# Altium schematic sheet ADC.SchDoc
size A3; Author: Швецов С.В.; Organization: PapuaSoft; SheetNumber: 2; SheetTotal: 8
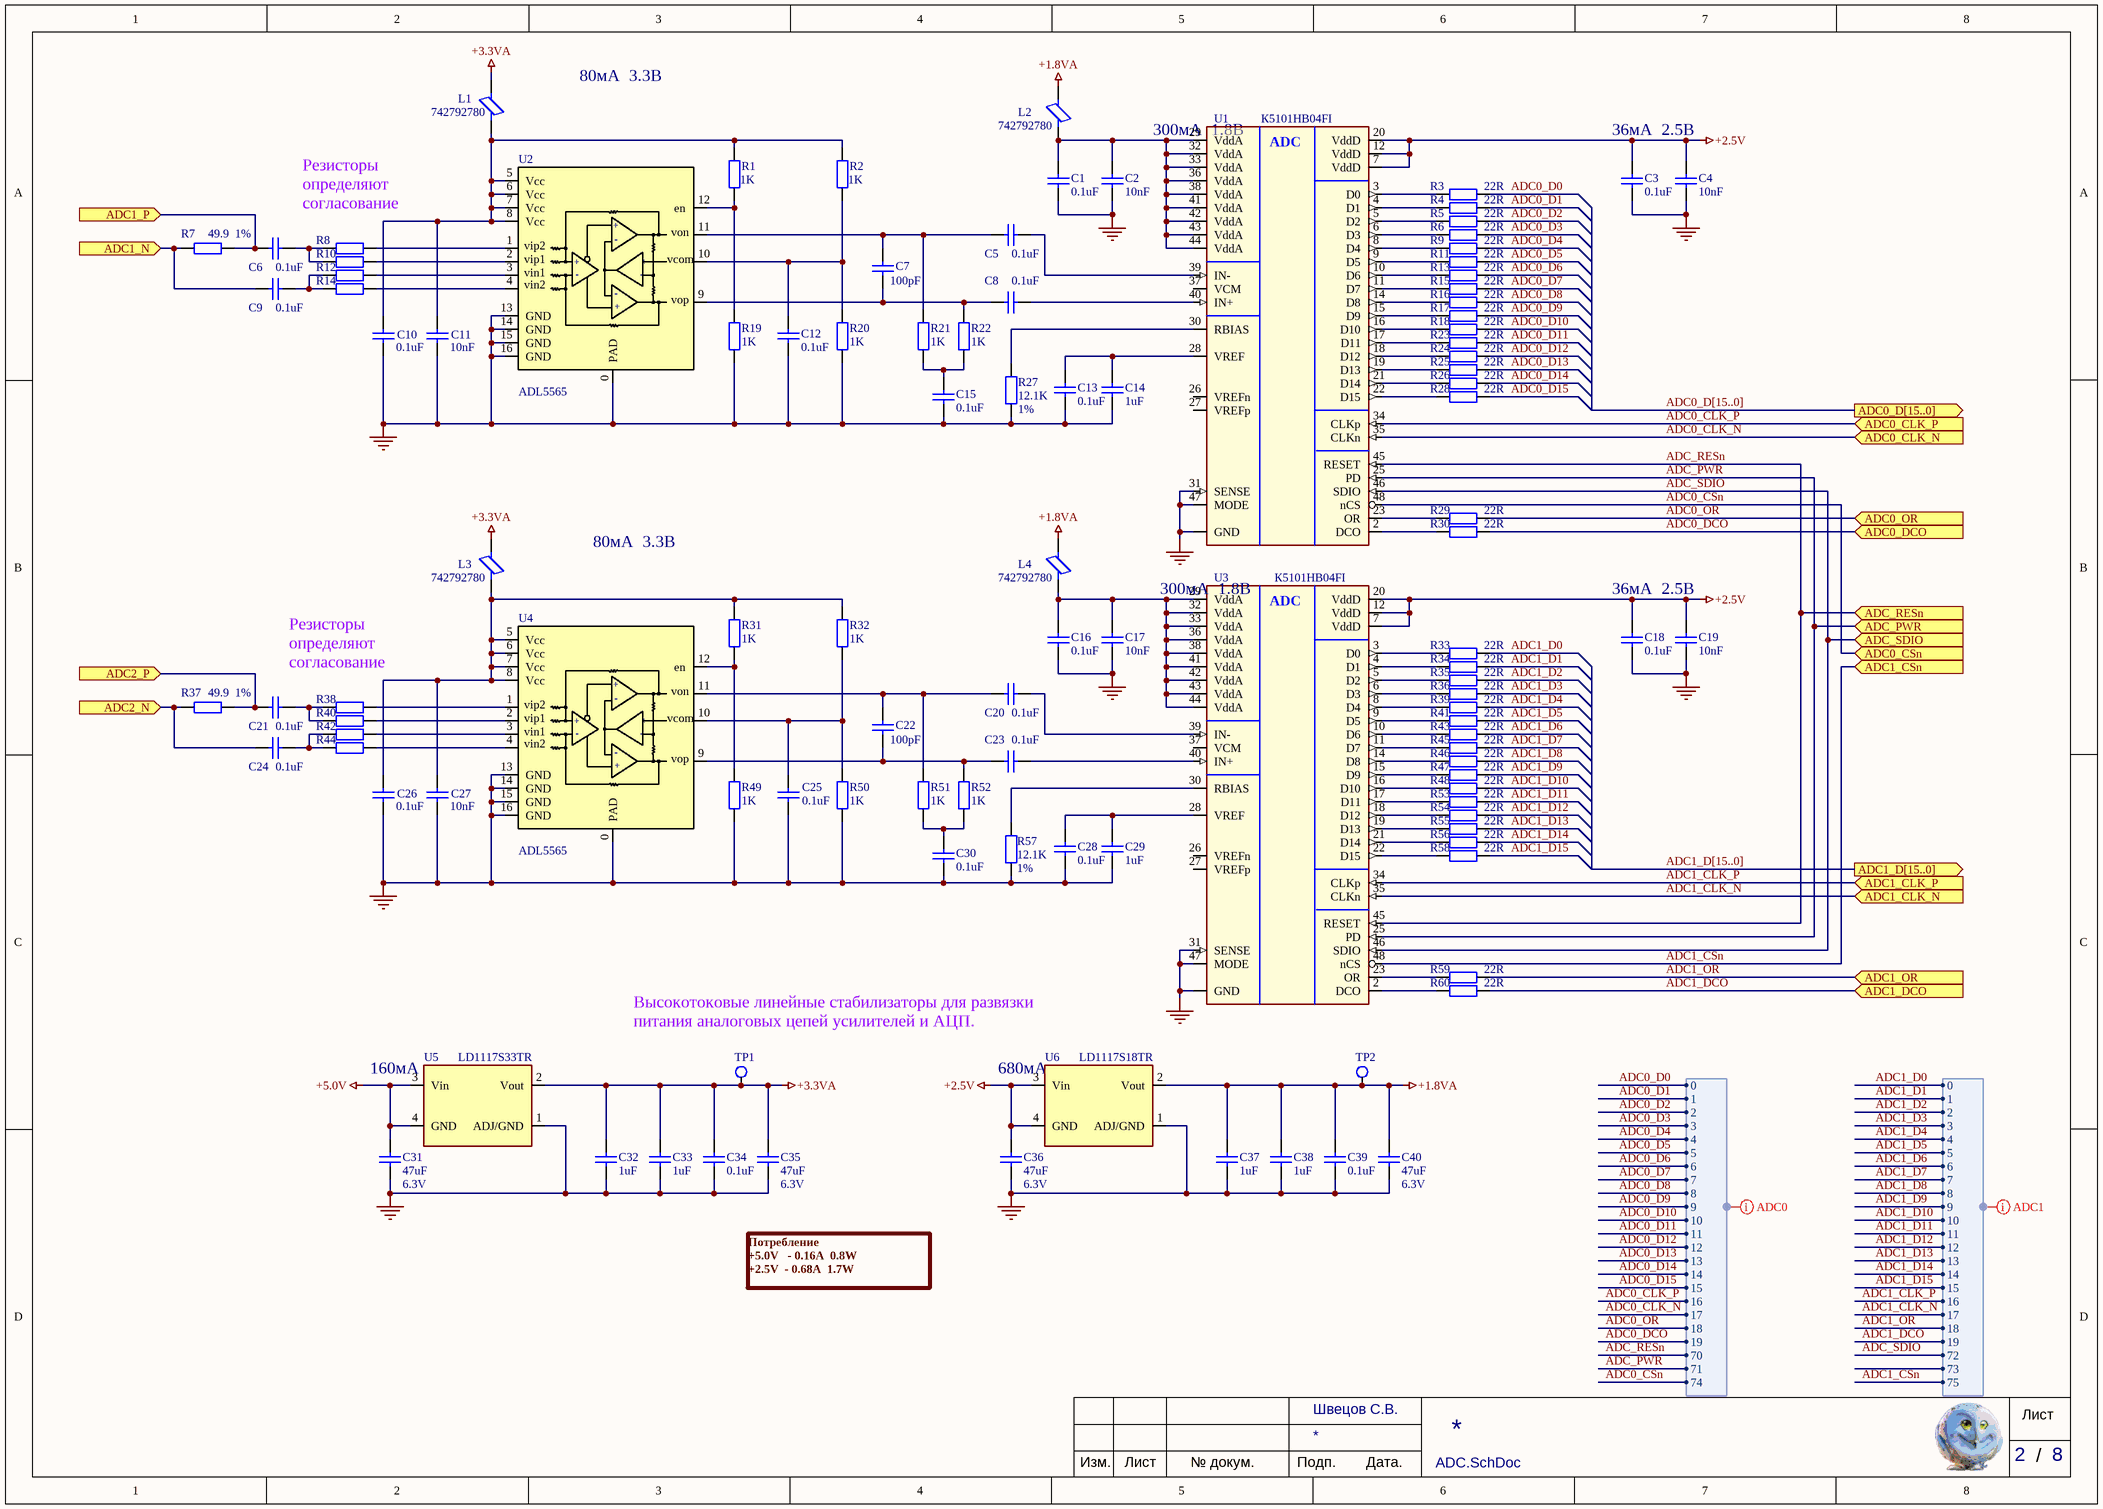
[diagram p0: ADC.SchDoc]

## Parts
C1  value 0.1uF  [C0402]  (hidden comment: Cap)
C2  value 10nF  [C0402]  (hidden comment: Cap)
C3  value 0.1uF  [C0402]  (hidden comment: Cap)
C4  value 10nF  [C0402]  (hidden comment: Cap)
C5  value 0.1uF  [C0402]  (hidden comment: Cap)
C6  value 0.1uF  [C0402]  (hidden comment: Cap)
C7  value 100pF  [C0402]  (hidden comment: Cap)
C8  value 0.1uF  [C0402]  (hidden comment: Cap)
C9  value 0.1uF  [C0402]  (hidden comment: Cap)
C10  value 0.1uF  [C0402]  (hidden comment: Cap)
C11  value 10nF  [C0402]  (hidden comment: Cap)
C12  value 0.1uF  [C0402]  (hidden comment: Cap)
C13  value 0.1uF  [C0402]  (hidden comment: Cap)
C14  value 1uF  [C0603]  (hidden comment: Cap)
C15  value 0.1uF  [C0402]  (hidden comment: Cap)
C16  value 0.1uF  [C0402]  (hidden comment: Cap)
C17  value 10nF  [C0402]  (hidden comment: Cap)
C18  value 0.1uF  [C0402]  (hidden comment: Cap)
C19  value 10nF  [C0402]  (hidden comment: Cap)
C20  value 0.1uF  [C0402]  (hidden comment: Cap)
C21  value 0.1uF  [C0402]  (hidden comment: Cap)
C22  value 100pF  [C0402]  (hidden comment: Cap)
C23  value 0.1uF  [C0402]  (hidden comment: Cap)
C24  value 0.1uF  [C0402]  (hidden comment: Cap)
C25  value 0.1uF  [C0402]  (hidden comment: Cap)
C26  value 0.1uF  [C0402]  (hidden comment: Cap)
C27  value 10nF  [C0402]  (hidden comment: Cap)
C28  value 0.1uF  [C0402]  (hidden comment: Cap)
C29  value 1uF  [C0603]  (hidden comment: Cap)
C30  value 0.1uF  [C0402]  (hidden comment: Cap)
C31  value 47uF  Voltage: 6.3V  [C0805]  (hidden comment: Cap)
C32  value 1uF  [C0603]  (hidden comment: Cap)
C33  value 1uF  [C0603]  (hidden comment: Cap)
C34  value 0.1uF  [C0402]  (hidden comment: Cap)
C35  value 47uF  Voltage: 6.3V  [C0805]  (hidden comment: Cap)
C36  value 47uF  Voltage: 6.3V  [C0805]  (hidden comment: Cap)
C37  value 1uF  [C0603]  (hidden comment: Cap)
C38  value 1uF  [C0603]  (hidden comment: Cap)
C39  value 0.1uF  [C0402]  (hidden comment: Cap)
C40  value 47uF  Voltage: 6.3V  [C0805]  (hidden comment: Cap)
L1  742792780  [L0402]
L2  742792780  [L0402]
L3  742792780  [L0402]
L4  742792780  [L0402]
R1  value 1K  [R0402]  (hidden comment: Res2)
R2  value 1K  [R0402]  (hidden comment: Res2)
R3  value 22R  [R0402]  (hidden comment: Res2)
R4  value 22R  [R0402]  (hidden comment: Res2)
R5  value 22R  [R0402]  (hidden comment: Res2)
R6  value 22R  [R0402]  (hidden comment: Res2)
R7  value 49.9  Precision: 1%  [R0402]  (hidden comment: Res2)
R8  Res2  [R0402]  (value not drawn)
R9  value 22R  [R0402]  (hidden comment: Res2)
R10  Res2  [R0402]  (value not drawn)
R11  value 22R  [R0402]  (hidden comment: Res2)
R12  Res2  [R0402]  (value not drawn)
R13  value 22R  [R0402]  (hidden comment: Res2)
R14  Res2  [R0402]  (value not drawn)
R15  value 22R  [R0402]  (hidden comment: Res2)
R16  value 22R  [R0402]  (hidden comment: Res2)
R17  value 22R  [R0402]  (hidden comment: Res2)
R18  value 22R  [R0402]  (hidden comment: Res2)
R19  value 1K  [R0402]  (hidden comment: Res2)
R20  value 1K  [R0402]  (hidden comment: Res2)
R21  value 1K  [R0402]  (hidden comment: Res2)
R22  value 1K  [R0402]  (hidden comment: Res2)
R23  value 22R  [R0402]  (hidden comment: Res2)
R24  value 22R  [R0402]  (hidden comment: Res2)
R25  value 22R  [R0402]  (hidden comment: Res2)
R26  value 22R  [R0402]  (hidden comment: Res2)
R27  value 12.1K  Precision: 1%  [R0402]  (hidden comment: Res2)
R28  value 22R  [R0402]  (hidden comment: Res2)
R29  value 22R  [R0402]  (hidden comment: Res2)
R30  value 22R  [R0402]  (hidden comment: Res2)
R31  value 1K  [R0402]  (hidden comment: Res2)
R32  value 1K  [R0402]  (hidden comment: Res2)
R33  value 22R  [R0402]  (hidden comment: Res2)
R34  value 22R  [R0402]  (hidden comment: Res2)
R35  value 22R  [R0402]  (hidden comment: Res2)
R36  value 22R  [R0402]  (hidden comment: Res2)
R37  value 49.9  Precision: 1%  [R0402]  (hidden comment: Res2)
R38  Res2  [R0402]  (value not drawn)
R39  value 22R  [R0402]  (hidden comment: Res2)
R40  Res2  [R0402]  (value not drawn)
R41  value 22R  [R0402]  (hidden comment: Res2)
R42  Res2  [R0402]  (value not drawn)
R43  value 22R  [R0402]  (hidden comment: Res2)
R44  Res2  [R0402]  (value not drawn)
R45  value 22R  [R0402]  (hidden comment: Res2)
R46  value 22R  [R0402]  (hidden comment: Res2)
R47  value 22R  [R0402]  (hidden comment: Res2)
R48  value 22R  [R0402]  (hidden comment: Res2)
R49  value 1K  [R0402]  (hidden comment: Res2)
R50  value 1K  [R0402]  (hidden comment: Res2)
R51  value 1K  [R0402]  (hidden comment: Res2)
R52  value 1K  [R0402]  (hidden comment: Res2)
R53  value 22R  [R0402]  (hidden comment: Res2)
R54  value 22R  [R0402]  (hidden comment: Res2)
R55  value 22R  [R0402]  (hidden comment: Res2)
R56  value 22R  [R0402]  (hidden comment: Res2)
R57  value 12.1K  Precision: 1%  [R0402]  (hidden comment: Res2)
R58  value 22R  [R0402]  (hidden comment: Res2)
R59  value 22R  [R0402]  (hidden comment: Res2)
R60  value 22R  [R0402]  (hidden comment: Res2)
TP1  (no value)  [TP_0MM5_1MM0]  (no BOM)
TP2  (no value)  [TP_0MM5_1MM0]  (no BOM)
U1  К5101НВ04FI  [VQFN48L]
U2  ADL5565  [CP_16_2_ADI-L]
U3  К5101НВ04FI  [VQFN48L]
U4  ADL5565  [CP_16_2_ADI-L]
U5  value LD1117S33TR  [SOT223]  (hidden comment: LD1117S12TR)
U6  value LD1117S18TR  [SOT223]  (hidden comment: LD1117S12TR)

## Ports
ADC0_CLK_N (in), ADC0_CLK_P (in), ADC0_CSn (in), ADC0_D[15..0] (out), ADC0_DCO (in), ADC0_OR (in), ADC1_CLK_N (in), ADC1_CLK_P (in), ADC1_CSn (in), ADC1_D[15..0] (out), ADC1_DCO (in), ADC1_N (in), ADC1_OR (in), ADC1_P (in), ADC2_N (in), ADC2_P (in), ADC_PWR (in), ADC_RESn (in), ADC_SDIO (in)

## Harnesses
ADC0: 0, 1, 2, 3, 4, 5, 6, 7, 8, 9, 11, 12, 10, 13, 14, 15, 16, 17, 18, 19, 70, 71, 74
ADC0: 0, 1, 2, 3, 4, 5, 6, 7, 8, 9, 11, 12, 10, 13, 14, 15, 16, 17, 18, 19, 72, 73, 75

## Nets
+1.8VA: C37.1 C38.1 C39.1 C40.1 L2.1 L4.1 TP2.1(e1) U6.2(Vout)
+2.5V: C3.1 C4.1 C18.1 C19.1 C36.1 U1.7(VddD) U1.12(VddD) U1.20(VddD) U3.7(VddD) U3.12(VddD) U3.20(VddD) U6.3(Vin) U6.4(GND)
+3.3VA: C32.1 C33.1 C34.1 C35.1 L1.1 L3.1 TP1.1(e1) U5.2(Vout)
+5.0V: C31.1 U5.3(Vin) U5.4(GND)
GND: C1.2 C2.2 C3.2 C4.2 C10.2 C11.2 C12.2 C13.2 C14.2 C15.2 C16.2 C17.2 C18.2 C19.2 C25.2 C26.2 C27.2 C28.2 C29.2 C30.2 C31.2 C32.2 C33.2 C34.2 C35.2 C36.2 C37.2 C38.2 C39.2 C40.2 R19.2 R20.2 R27.2 R49.2 R50.2 R57.2 U1.0(GND) U1.31(SENSE) U1.47(MODE) U2.0(PAD) U2.13(GND) U2.14(GND) U2.15(GND) U2.16(GND) U3.0(GND) U3.31(SENSE) U3.47(MODE) U4.0(PAD) U4.13(GND) U4.14(GND) U4.15(GND) U4.16(GND) U5.1(ADJ/GND) U6.1(ADJ/GND)
ADC0_CLK_N: U1.35(CLKn) ; port ADC0_CLK_N, harness ADC0.17
ADC0_CLK_P: U1.34(CLKp) ; port ADC0_CLK_P, harness ADC0.16
ADC0_CSn: U1.48(nCS) ; port ADC0_CSn, harness ADC0.74
ADC0_D0: R3.2 ; harness ADC0.0
ADC0_D1: R4.2 ; harness ADC0.1
ADC0_D2: R5.2 ; harness ADC0.2
ADC0_D3: R6.2 ; harness ADC0.3
ADC0_D4: R9.2 ; harness ADC0.4
ADC0_D5: R11.2 ; harness ADC0.5
ADC0_D6: R13.2 ; harness ADC0.6
ADC0_D7: R15.2 ; harness ADC0.7
ADC0_D8: R16.2 ; harness ADC0.8
ADC0_D9: R17.2 ; harness ADC0.9
ADC0_D10: R18.2 ; harness ADC0.10
ADC0_D11: R23.2 ; harness ADC0.11
ADC0_D12: R24.2 ; harness ADC0.12
ADC0_D13: R25.2 ; harness ADC0.13
ADC0_D14: R26.2 ; harness ADC0.14
ADC0_D15: R28.2 ; harness ADC0.15
ADC0_DCO: R30.2 ; port ADC0_DCO, harness ADC0.19
ADC0_OR: R29.2 ; port ADC0_OR, harness ADC0.18
ADC1_CLK_N: U3.35(CLKn) ; port ADC1_CLK_N, harness ADC0.17
ADC1_CLK_P: U3.34(CLKp) ; port ADC1_CLK_P, harness ADC0.16
ADC1_CSn: U3.48(nCS) ; port ADC1_CSn, harness ADC0.75
ADC1_D0: R33.2 ; harness ADC0.0
ADC1_D1: R34.2 ; harness ADC0.1
ADC1_D2: R35.2 ; harness ADC0.2
ADC1_D3: R36.2 ; harness ADC0.3
ADC1_D4: R39.2 ; harness ADC0.4
ADC1_D5: R41.2 ; harness ADC0.5
ADC1_D6: R43.2 ; harness ADC0.6
ADC1_D7: R45.2 ; harness ADC0.7
ADC1_D8: R46.2 ; harness ADC0.8
ADC1_D9: R47.2 ; harness ADC0.9
ADC1_D10: R48.2 ; harness ADC0.10
ADC1_D11: R53.2 ; harness ADC0.11
ADC1_D12: R54.2 ; harness ADC0.12
ADC1_D13: R55.2 ; harness ADC0.13
ADC1_D14: R56.2 ; harness ADC0.14
ADC1_D15: R58.2 ; harness ADC0.15
ADC1_DCO: R60.2 ; port ADC1_DCO, harness ADC0.19
ADC1_N: C9.2 R7.1 ; port ADC1_N
ADC1_OR: R59.2 ; port ADC1_OR, harness ADC0.18
ADC1_P: C6.2 R7.2 ; port ADC1_P
ADC2_N: C24.2 R37.1 ; port ADC2_N
ADC2_P: C21.2 R37.2 ; port ADC2_P
ADC_PWR: U1.25(PD) U3.25(PD) ; port ADC_PWR, harness ADC0.71
ADC_RESn: U1.45(RESET) U3.45(RESET) ; port ADC_RESn, harness ADC0.70
ADC_SDIO: U1.46(SDIO) U3.46(SDIO) ; port ADC_SDIO, harness ADC0.72
NetC1_1: C1.1 C2.1 L2.2 U1.29(VddA) U1.32(VddA) U1.33(VddA) U1.36(VddA) U1.38(VddA) U1.41(VddA) U1.42(VddA) U1.43(VddA) U1.44(VddA)
NetC5_1: C5.1 U1.39(IN-)
NetC5_2: C5.2 C7.1 R21.1 U2.11(von)
NetC6_1: C6.1 R8.1 R10.1
NetC7_2: C7.2 C8.2 R22.1 U2.9(vop)
NetC8_1: C8.1 U1.40(IN+)
NetC9_1: C9.1 R12.1 R14.1
NetC10_1: C10.1 C11.1 L1.2 R1.1 R2.1 U2.5(Vcc) U2.6(Vcc) U2.7(Vcc) U2.8(Vcc)
NetC12_1: C12.1 R2.2 R20.1 U2.10(vcom)
NetC13_1: C13.1 C14.1 U1.28(VREF)
NetC15_1: C15.1 R21.2 R22.2
NetC16_1: C16.1 C17.1 L4.2 U3.29(VddA) U3.32(VddA) U3.33(VddA) U3.36(VddA) U3.38(VddA) U3.41(VddA) U3.42(VddA) U3.43(VddA) U3.44(VddA)
NetC20_1: C20.1 U3.39(IN-)
NetC20_2: C20.2 C22.1 R51.1 U4.11(von)
NetC21_1: C21.1 R38.1 R40.1
NetC22_2: C22.2 C23.2 R52.1 U4.9(vop)
NetC23_1: C23.1 U3.40(IN+)
NetC24_1: C24.1 R42.1 R44.1
NetC25_1: C25.1 R32.2 R50.1 U4.10(vcom)
NetC26_1: C26.1 C27.1 L3.2 R31.1 R32.1 U4.5(Vcc) U4.6(Vcc) U4.7(Vcc) U4.8(Vcc)
NetC28_1: C28.1 C29.1 U3.28(VREF)
NetC30_1: C30.1 R51.2 R52.2
NetR1_2: R1.2 R19.1 U2.12(en)
NetR3_1: R3.1 U1.3(D0)
NetR4_1: R4.1 U1.4(D1)
NetR5_1: R5.1 U1.5(D2)
NetR6_1: R6.1 U1.6(D3)
NetR8_2: R8.2 U2.1(vip2)
NetR9_1: R9.1 U1.8(D4)
NetR10_2: R10.2 U2.2(vip1)
NetR11_1: R11.1 U1.9(D5)
NetR12_2: R12.2 U2.3(vin1)
NetR13_1: R13.1 U1.10(D6)
NetR14_2: R14.2 U2.4(vin2)
NetR15_1: R15.1 U1.11(D7)
NetR16_1: R16.1 U1.14(D8)
NetR17_1: R17.1 U1.15(D9)
NetR18_1: R18.1 U1.16(D10)
NetR23_1: R23.1 U1.17(D11)
NetR24_1: R24.1 U1.18(D12)
NetR25_1: R25.1 U1.19(D13)
NetR26_1: R26.1 U1.21(D14)
NetR27_1: R27.1 U1.30(RBIAS)
NetR28_1: R28.1 U1.22(D15)
NetR29_1: R29.1 U1.23(OR)
NetR30_1: R30.1 U1.2(DCO)
NetR31_2: R31.2 R49.1 U4.12(en)
NetR33_1: R33.1 U3.3(D0)
NetR34_1: R34.1 U3.4(D1)
NetR35_1: R35.1 U3.5(D2)
NetR36_1: R36.1 U3.6(D3)
NetR38_2: R38.2 U4.1(vip2)
NetR39_1: R39.1 U3.8(D4)
NetR40_2: R40.2 U4.2(vip1)
NetR41_1: R41.1 U3.9(D5)
NetR42_2: R42.2 U4.3(vin1)
NetR43_1: R43.1 U3.10(D6)
NetR44_2: R44.2 U4.4(vin2)
NetR45_1: R45.1 U3.11(D7)
NetR46_1: R46.1 U3.14(D8)
NetR47_1: R47.1 U3.15(D9)
NetR48_1: R48.1 U3.16(D10)
NetR53_1: R53.1 U3.17(D11)
NetR54_1: R54.1 U3.18(D12)
NetR55_1: R55.1 U3.19(D13)
NetR56_1: R56.1 U3.21(D14)
NetR57_1: R57.1 U3.30(RBIAS)
NetR58_1: R58.1 U3.22(D15)
NetR59_1: R59.1 U3.23(OR)
NetR60_1: R60.1 U3.2(DCO)

Not connected (* = marked no-connect by the designer): U1 26(VREFn) 27(VREFp) 37(VCM); U3 26(VREFn) 27(VREFp) 37(VCM)

## Buses and harness runs
bus ADC0_D[15..0] = port ADC0_D[15..0]
bus ADC1_D[15..0] = port ADC1_D[15..0]

## Layout directives
net class ADC: (no net found under the mark)

## Notes on the sheet
- (near L1) 80мА  3.3В
- (near L2) 300мА  1.8В
- (near C3) 36мА  2.5В
- Резисторы определяют согласование
- (near L3) 80мА  3.3В
- (near L4) 300мА  1.8В
- (near C18) 36мА  2.5В
- Высокотоковые линейные стабилизаторы для развязки питания аналоговых цепей усилителей и АЦП.
- 160мА
- 680мА
- Потребление
  +5.0V   - 0.16A  0.8W
  +2.5V  - 0.68A  1.7W
- Лист
- /
- Изм.
- № докум.
- Подп.
- Дата.
- (in symbol ADL5565) +; -
- (in symbol К5101НВ04FI) ADC

## Library data of the parts
C1-C6 C8-C13 C15-C21 C23-C28 C30 C34 C39 = Cap: Конденсатор керамический; Voltage: 25V; PackageReference: 0402
  C1-C6 C8-C13 C15: ClassName: ADC-1
  C16-C21 C23-C28 C30: ClassName: ADC-2
  C34 C39: ClassName: ADC_POWER
C7 C14 C22 C29 C32 C33 C37 C38 = Cap: Конденсатор керамический
  C7: PackageReference: 0402; ClassName: ADC-1
  C14: PackageReference: 0603; ClassName: ADC-1
  C22: PackageReference: 0402; ClassName: ADC-2
  C29: PackageReference: 0603; ClassName: ADC-2
  C32 C33 C37 C38: PackageReference: 0603; ClassName: ADC_POWER
C31 C35 C36 C40 = Cap: C0805C476M9PAC; PackageReference: 0805; ClassName: Xilinx PWR
L1-L4 = BEAD_FERRITE_SM: Wurth Elektronik EMI FILTERS FERRITE BEAD, 220R@100MHz, 0.35R; PackageReference: 0402; Value: 742792780
  L1 L2: ClassName: ADC-1
  L3 L4: ClassName: ADC-2
R1-R7 R9 R11 R13 R15-R37 R39 R41 R43 R45-R60 = Res2: Резистор; PackageReference: 0402
  R1-R7 R9 R11 R13 R15-R30: ClassName: ADC-1
  R31-R37 R39 R41 R43 R45-R60: ClassName: ADC-2
R8 R10 R12 R14 R38 R40 R42 R44 = Res2: Резистор; Value: 0R; PackageReference: 0402
  R8 R10 R12 R14: ClassName: ADC-1
  R38 R40 R42 R44: ClassName: ADC-2
TP1 = Test_Point: Тестовая точка на плате; MarkPCB: +3.3V; ClassName: ADC_POWER
TP2 = Test_Point: Тестовая точка на плате; MarkPCB: +1.8V; ClassName: ADC_POWER
U1 U3 = К5101НВ04FI: АЦП 95мГц 14бит; PackageReference: VQFN48L; Value: К5101НВ04FI
  U1: ClassName: ADC-1
  U3: ClassName: ADC-2
U2 U4 = ADL5565: 6 GHz Differential Amplifier; Value: ADL5565; PackageReference: LFCSP-16
  U2: ClassName: ADC-1
  U4: ClassName: ADC-2
U5 = LD1117S12TR: Линейный стабилизатор +3.3V; PackageReference: SOT223; ClassName: ADC_POWER
U6 = LD1117S12TR: Линейный стабилизатор 1.8V; PackageReference: SOT223; ClassName: ADC_POWER